# Altium project RF-UNIT.PrjPcb
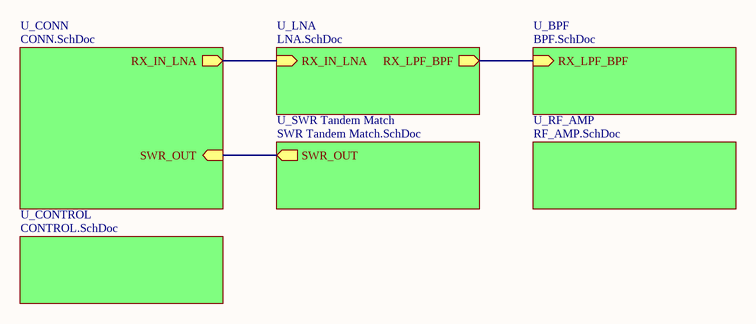
[diagram p0: RF-UNIT.SCHDOC]
7 sheets, 244 parts. Net scope: global (net labels, ports and power ports of the same name join across sheets).
Board file: RF-UNIT.PcbDoc
Sheets:
  RF-UNIT.SCHDOC
    U_BPF = BPF.SchDoc
    U_CONN = CONN.SchDoc
    U_CONTROL = CONTROL.SchDoc
    U_LNA = LNA.SchDoc
    U_RF_AMP = RF_AMP.SchDoc
    U_SWR Tandem Match = SWR Tandem Match.SchDoc

## Sheet RF-UNIT.SCHDOC: RF-UNIT
size A4; DocumentNumber: 12; Revision: 1.9; SheetNumber: 12; SheetTotal: 18

### Sub-sheets
U_BPF = BPF.SchDoc: RX_LPF_BPF (in)
U_CONN = CONN.SchDoc: RX_IN_LNA (out), SWR_OUT (in)
U_CONTROL = CONTROL.SchDoc: no entries
U_LNA = LNA.SchDoc: RX_IN_LNA (in), RX_LPF_BPF (out)
U_RF_AMP = RF_AMP.SchDoc: no entries
U_SWR Tandem Match = SWR Tandem Match.SchDoc: SWR_OUT (out)

### Nets
(unnamed): sheet U_BPF/RX_LPF_BPF, sheet U_LNA/RX_LPF_BPF
(unnamed): sheet U_CONN/RX_IN_LNA, sheet U_LNA/RX_IN_LNA
(unnamed): sheet U_CONN/SWR_OUT, sheet U_SWR Tandem Match/SWR_OUT

### Notes on the sheet
- Title
- Size:
- Date:
- A4
- Number:
- Time:
- Revision:
- Sheet
- of
- File:

## Sheet BPF.SchDoc: BPF
size A2 portrait; DocumentNumber: 13; Revision: 2.0; SheetNumber: 13; SheetTotal: 18; DocumentName: Лист 1.SCHDOC
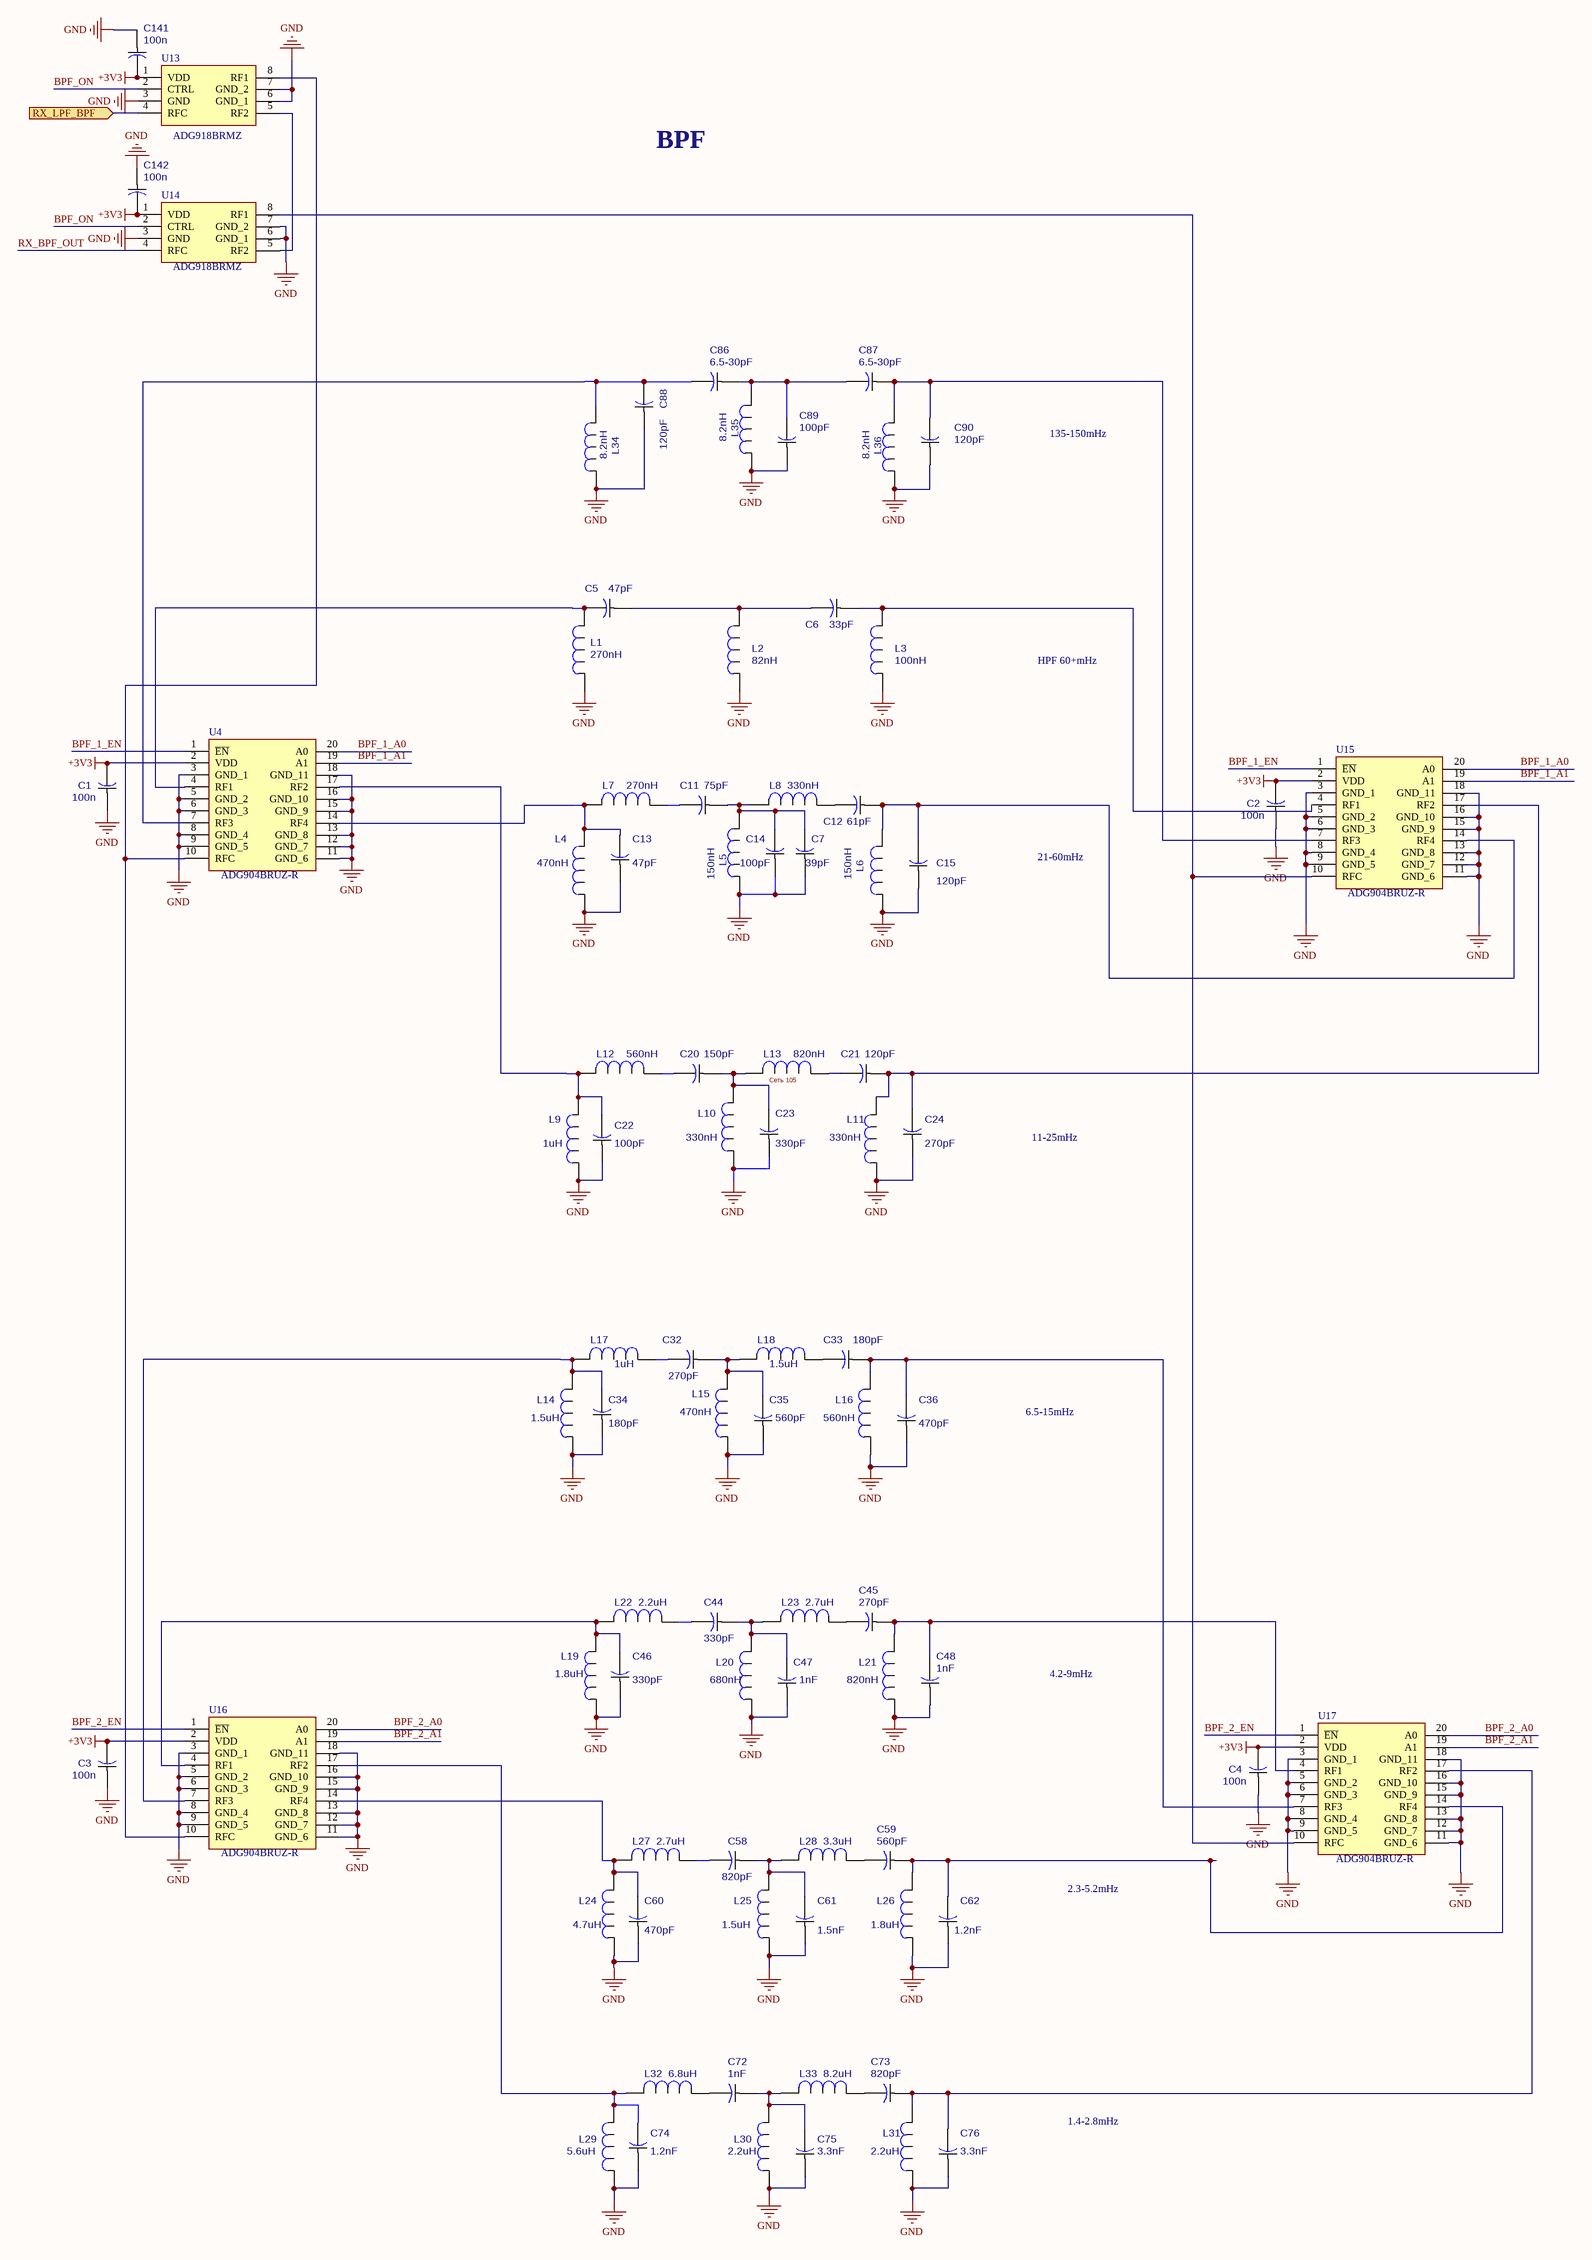
[diagram p1: BPF.SchDoc]

### Parts
C1  100n  [CAP_0805]
C2  100n  [CAP_0805]
C3  100n  [CAP_0805]
C4  100n  [CAP_0805]
C5  47pF  [CAP_0805]
C6  33pF  [CAP_0805]
C7  39pF  [CAP_0805]
C11  75pF  [CAP_0805]
C12  61pF  [CAP_0805]
C13  47pF  [CAP_0805]
C14  100pF  [CAP_0805]
C15  120pF  [CAP_0805]
C20  150pF  [CAP_0805]
C21  120pF  [CAP_0805]
C22  100pF  [CAP_0805]
C23  330pF  [CAP_0805]
C24  270pF  [CAP_0805]
C32  270pF  [CAP_0805]
C33  180pF  [CAP_0805]
C34  180pF  [CAP_0805]
C35  560pF  [CAP_0805]
C36  470pF  [CAP_0805]
C44  330pF  [CAP_0805]
C45  value 270pF  [CAP_0805]  (hidden comment: 51pF)
C46  330pF  [CAP_0805]
C47  1nF  [CAP_0805]
C48  1nF  [CAP_0805]
C58  820pF  [CAP_0805]
C59  value 560pF  [CAP_0805]  (hidden comment: 680pF)
C60  470pF  [CAP_0805]
C61  1.5nF  [CAP_0805]
C62  1.2nF  [CAP_0805]
C72  1nF  [CAP_0805]
C73  820pF  [CAP_0805]
C74  1.2nF  [CAP_0805]
C75  3.3nF  [CAP_0805]
C76  3.3nF  [CAP_0805]
C86  6.5-30pF  [5025[2010]]
C87  6.5-30pF  [5025[2010]]
C88  120pF  [CAP_0805]
C89  100pF  [CAP_0805]
C90  120pF  [CAP_0805]
C141  100n  [CAP_0805]
C142  100n  [CAP_0805]
L1  270nH  [IND_0805]
L2  82nH  [IND_0805]
L3  100nH  [IND_0805]
L4  470nH  [IND_0805]
L5  150nH  [IND_0805]
L6  150nH  [IND_0805]
L7  270nH  [IND_0805]
L8  330nH  [IND_0805]
L9  1uH  [IND_0805]
L10  330nH  [IND_0805]
L11  330nH  [IND_0805]
L12  560nH  [IND_0805]
L13  820nH  [IND_0805]
L14  1.5uH  [IND_0805]
L15  470nH  [IND_0805]
L16  560nH  [IND_0805]
L17  1uH  [IND_0805]
L18  1.5uH  [IND_0805]
L19  1.8uH  [IND_0805]
L20  680nH  [IND_0805]
L21  820nH  [IND_0805]
L22  2.2uH  [IND_0805]
L23  2.7uH  [IND_0805]
L24  4.7uH  [IND_0805]
L25  1.5uH  [IND_0805]
L26  1.8uH  [IND_0805]
L27  2.7uH  [IND_0805]
L28  3.3uH  [IND_0805]
L29  5.6uH  [IND_0805]
L30  2.2uH  [IND_0805]
L31  2.2uH  [IND_0805]
L32  6.8uH  [IND_0805]
L33  8.2uH  [IND_0805]
L34  8.2nH  [IND_0805]
L35  8.2nH  [IND_0805]
L36  8.2nH  [IND_0805]
U4  ADG904BRUZ-R  [SOP65P640X120-20N]
U13  ADG918BRMZ  [SOP65P490X110-8N]
U14  ADG918BRMZ  [SOP65P490X110-8N]
U15  ADG904BRUZ-R  [SOP65P640X120-20N]
U16  ADG904BRUZ-R  [SOP65P640X120-20N]
U17  ADG904BRUZ-R  [SOP65P640X120-20N]

### Ports
RX_LPF_BPF (in)

### Nets
+3V3: C1.2 C2.2 C3.2 C4.2 C141.2 C142.2 U4.2(VDD) U13.1(VDD) U14.1(VDD) U15.2(VDD) U16.2(VDD) U17.2(VDD)
GND: C1.1 C2.1 C3.1 C4.1 C7.1 C13.1 C14.1 C15.1 C22.1 C23.1 C24.1 C34.1 C35.1 C36.1 C46.1 C47.1 C48.1 C60.1 C61.1 C62.1 C74.1 C75.1 C76.1 C88.1 C89.1 C90.1 C141.1 C142.1 L1.1 L2.1 L3.1 L4.1 L5.1 L6.1 L9.1 L10.1 L11.1 L14.1 L15.1 L16.1 L19.1 L20.1 L21.1 L24.1 L25.1 L26.1 L29.1 L30.1 L31.1 L34.1 L35.1 L36.1 U4.3(GND_1) U4.5(GND_2) U4.6(GND_3) U4.8(GND_4) U4.9(GND_5) U4.11(GND_6) U4.12(GND_7) U4.13(GND_8) U4.15(GND_9) U4.16(GND_10) U4.18(GND_11) U13.3(GND) U13.6(GND_1) U13.7(GND_2) U14.3(GND) U14.6(GND_1) U14.7(GND_2) U15.3(GND_1) U15.5(GND_2) U15.6(GND_3) U15.8(GND_4) U15.9(GND_5) U15.11(GND_6) U15.12(GND_7) U15.13(GND_8) U15.15(GND_9) U15.16(GND_10) U15.18(GND_11) U16.3(GND_1) U16.5(GND_2) U16.6(GND_3) U16.8(GND_4) U16.9(GND_5) U16.11(GND_6) U16.12(GND_7) U16.13(GND_8) U16.15(GND_9) U16.16(GND_10) U16.18(GND_11) U17.3(GND_1) U17.5(GND_2) U17.6(GND_3) U17.8(GND_4) U17.9(GND_5) U17.11(GND_6) U17.12(GND_7) U17.13(GND_8) U17.15(GND_9) U17.16(GND_10) U17.18(GND_11)
BPF_1_A0: U4.20(A0) U15.20(A0)
BPF_1_A1: U4.19(A1) U15.19(A1)
BPF_1_EN: U4.1(~{EN}) U15.1(~{EN})
BPF_2_A0: U16.20(A0) U17.20(A0)
BPF_2_A1: U16.19(A1) U17.19(A1)
BPF_2_EN: U16.1(~{EN}) U17.1(~{EN})
BPF_ON: U13.2(CTRL) U14.2(CTRL)
RX_BPF_OUT: U14.4(RFC)
RX_LPF_BPF: U13.4(RFC) ; port RX_LPF_BPF
Сеть 105: C20.1 C23.2 L10.2 L13.1
NetC5_1: C5.1 C6.2 L2.2
NetC5_2: C5.2 L1.2 U4.4(RF1)
NetC6_1: C6.1 L3.2 U15.4(RF1)
NetC7_2: C7.2 C11.1 C14.2 L5.2 L8.1
NetC11_2: C11.2 L7.2
NetC12_1: C12.1 C15.2 L6.2 U15.14(RF4)
NetC12_2: C12.2 L8.2
NetC13_2: C13.2 L4.2 L7.1 U4.14(RF4)
NetC20_2: C20.2 L12.2
NetC21_1: C21.1 C24.2 L11.2 U15.17(RF2)
NetC21_2: C21.2 L13.2
NetC22_2: C22.2 L9.2 L12.1 U4.17(RF2)
NetC32_1: C32.1 C35.2 L15.2 L18.1
NetC32_2: C32.2 L17.2
NetC33_1: C33.1 C36.2 L16.2 U17.7(RF3)
NetC33_2: C33.2 L18.2
NetC34_2: C34.2 L14.2 L17.1 U16.7(RF3)
NetC44_1: C44.1 C47.2 L20.2 L23.1
NetC44_2: C44.2 L22.2
NetC45_1: C45.1 C48.2 L21.2 U17.4(RF1)
NetC45_2: C45.2 L23.2
NetC46_2: C46.2 L19.2 L22.1 U16.4(RF1)
NetC58_1: C58.1 C61.2 L25.2 L28.1
NetC58_2: C58.2 L27.2
NetC59_1: C59.1 C62.2 L26.2 U17.14(RF4)
NetC59_2: C59.2 L28.2
NetC60_2: C60.2 L24.2 L27.1 U16.14(RF4)
NetC72_1: C72.1 C75.2 L30.2 L33.1
NetC72_2: C72.2 L32.2
NetC73_1: C73.1 C76.2 L31.2 U17.17(RF2)
NetC73_2: C73.2 L33.2
NetC74_2: C74.2 L29.2 L32.1 U16.17(RF2)
NetC86_1: C86.1 C87.2 C89.2 L35.2
NetC86_2: C86.2 C88.2 L34.2 U4.7(RF3)
NetC87_1: C87.1 C90.2 L36.2 U15.7(RF3)
NetU4_10: U4.10(RFC) U13.8(RF1) U16.10(RFC)
NetU13_5: U13.5(RF2) U14.5(RF2)
NetU14_8: U14.8(RF1) U15.10(RFC) U17.10(RFC)

### Notes on the sheet
- BPF
- 135-150mHz
- HPF 60+mHz
- 21-60mHz
- 11-25mHz
- 6.5-15mHz
- 4.2-9mHz
- 2.3-5.2mHz
- 1.4-2.8mHz
- Title
- Size:
- Date:
- File:
- A2
- Number:
- Time:
- Revision:
- Sheet
- of

### Library data of the parts
C1-C7 C11-C15 C20-C24 C32-C36 C44-C48 C58-C62 C72-C76 C88-C90 C141 C142 = CAP_0805
  C1-C4 C141 C142: Value: 100n
  C5 C13: Value: 47pF
  C6: Value: 33pF
  C7: Value: 39pF
  C11: Value: 75pF
  C12: Value: 61pF
  C14 C89: Value: 100pF
  C15 C88 C90: Value: 120pF
  C44 C46: Value: 330pF
  C47 C48 C72: Value: 1nF
  C58 C73: Value: 820pF
  C60: Value: 470pF
  C61: Value: 1.5nF
  C62 C74: Value: 1.2nF
  C75 C76: Value: 3.3nF
C86 C87 = CAP_0805: TZC3P300A110; Value: 6.5-30pF
L1-L36 = IND_0805
  L1 L7: Value: 270nH
  L2: Value: 82nH
  L3: Value: 100nH
  L4: Value: 470nH
  L5 L6: Value: 150nH
  L8: Value: 330nH
  L19 L26: Value: 1.8uH
  L20: Value: 680nH
  L21: Value: 820nH
  L22 L30 L31: Value: 2.2uH
  L23 L27: Value: 2.7uH
  L24: Value: 4.7uH
  L25: Value: 1.5uH
  L28: Value: 3.3uH
  L29: Value: 5.6uH
  L32: Value: 6.8uH
  L33: Value: 8.2uH
  L34-L36: Value: 8.2nH
U4 U15-U17 = ADG904BRUZ-R: Integrated Circuit; Manufacturer_Name: Analog Devices; Datasheet Link: http://www.analog.com/static/imported-files/data_sheets/ADG904_904R.pdf; Height: 1.2mm; Manufacturer_Part_Number: ADG904BRUZ-R; Mouser Part Number: 584-ADG904BRUZ-R; Mouser Price/Stock: https://www.mouser.com/Search/Refine.aspx?Keyword=584-ADG904BRUZ-R; RS Part Number: 5385019P; RS Price/Stock: http://uk.rs-online.com/web/p/products/5385019P
U13 U14 = ADG918BRMZ: Integrated Circuit; Manufacturer_Name: Analog Devices; Datasheet Link: http://www.analog.com/static/imported-files/data_sheets/ADG918_919.pdf; Height: 1.1mm; Manufacturer_Part_Number: ADG918BRMZ; Mouser Part Number: 584-ADG918BRMZ; Mouser Price/Stock: https://www.mouser.co.uk/ProductDetail/Analog-Devices/ADG918BRMZ?qs=BpaRKvA4VqHrp1TCwMhfnw%3D%3D; RS Part Number: 4969212P; RS Price/Stock: http://uk.rs-online.com/web/p/products/4969212P
  U14: LCSC Part #: test

## Sheet CONN.SchDoc: CONN
size A4; DocumentNumber: 14; Revision: 2.0; SheetNumber: 14; SheetTotal: 18
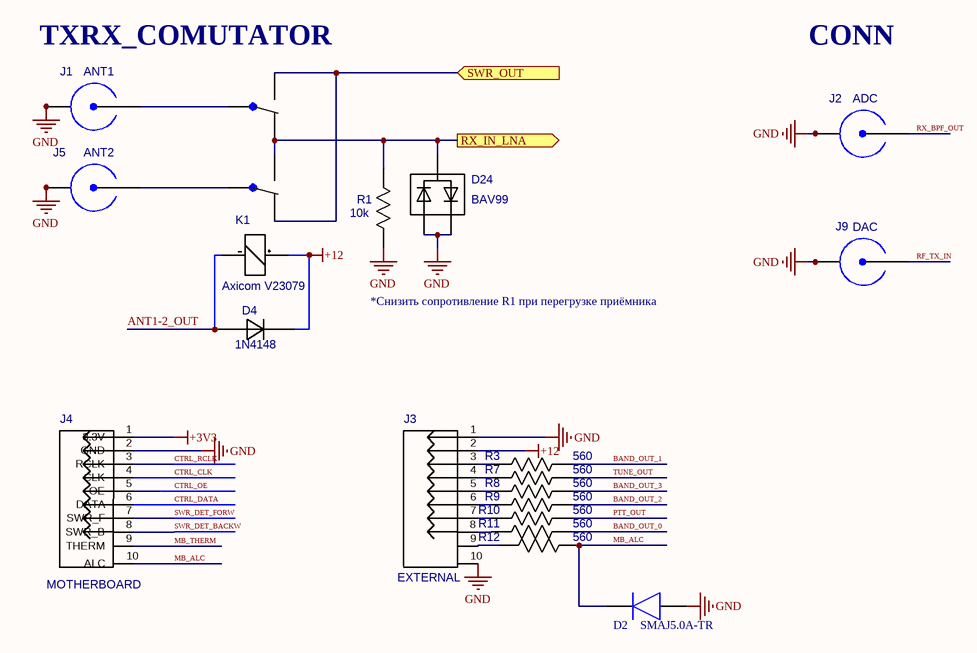
[diagram p2: CONN.SchDoc]

### Parts
D2  SMAJ5.0A-TR  [SMBJ36CATR]
D4  1N4148  [1N4148]
D24  BAV99  [SOT23]
J1  ANT1  [31-5431]
J2  ADC  [31-5431]
J3  EXTERNAL  [90131-0126]
J4  MOTHERBOARD  [90131-0126]
J5  ANT2  [31-5431]
J9  DAC  [31-5431]
K1  Axicom V23079  [V23079]
R1  10k  [RES_1206]
R3  560  [RES_0805]
R7  560  [RES_0805]
R8  560  [RES_0805]
R9  560  [RES_0805]
R10  560  [RES_0805]
R11  560  [RES_0805]
R12  560  [RES_0805]

### Ports
RX_IN_LNA (out), SWR_OUT (in)

### Nets
+3V3: J4.1(3.3V)
+12: D4.1(K) J3.2(12V) K1.1(+)
GND: D2.2(A) D24.1(A(D1)) D24.2(C(D2)) J1.1(GND) J1.2(GND) J1.3(GND) J1.4(GND) J2.1(GND) J2.2(GND) J2.3(GND) J2.4(GND) J3.1(GND) J3.10(GND) J4.2(GND) J5.1(GND) J5.2(GND) J5.3(GND) J5.4(GND) J9.1(GND) J9.2(GND) J9.3(GND) J9.4(GND) R1.1
ANT1-2_OUT: D4.2(A) K1.8(-)
BAND_OUT_0: R11.2
BAND_OUT_1: R3.2
BAND_OUT_2: R9.2
BAND_OUT_3: R8.2
CTRL_CLK: J4.4(CLK)
CTRL_DATA: J4.6(DATA)
CTRL_OE: J4.5(OE)
CTRL_RCLK: J4.3(RCLK)
MB_ALC: D2.1(K) J4.10(ALC) R12.2
MB_THERM: J4.9(THERM)
PTT_OUT: R10.2
RF_TX_IN: J9.5(CON)
RX_BPF_OUT: J2.5(CON)
RX_IN_LNA: D24.3(C(D1),A(D2)) K1.4(S) K1.7(O) R1.2 ; port RX_IN_LNA
SWR_DET_BACKW: J4.8(SWR_B)
SWR_DET_FORW: J4.7(SWR_F)
SWR_OUT: K1.2(O) K1.5(S) ; port SWR_OUT
TUNE_OUT: R7.2
NetJ1_5: J1.5(CON) K1.6(P)
NetJ3_3: J3.3(BAND1) R3.1
NetJ3_4: J3.4(TUNE_OUT) R7.1
NetJ3_5: J3.5(BAND3) R8.1
NetJ3_6: J3.6(BAND2) R9.1
NetJ3_7: J3.7(PTT_OUT) R10.1
NetJ3_8: J3.8(BAND0) R11.1
NetJ3_9: J3.9(ALC_IN) R12.1
NetJ5_5: J5.5(CON) K1.3(P)

### Notes on the sheet
- TXRX_COMUTATOR
- CONN
- *Снизить сопротивление R1 при перегрузке приёмника
- Title
- Size:
- Date:
- A4
- Number:
- Time:
- Revision:
- Sheet
- of
- File:

### Library data of the parts
D2 = SMLVT3V3: Diode; Manufacturer_Name: STMicroelectronics; Allied_Number: 70013736; Datasheet Link: http://www.st.com/web/en/resource/technical/document/datasheet/CD00000923.pdf; Height: 2.65mm; Manufacturer_Part_Number: SMLVT3V3; Mouser Part Number: 511-SMLVT3V3; Mouser Price/Stock: https://www.mouser.com/Search/Refine.aspx?Keyword=511-SMLVT3V3; RS Part Number: 5444821P; RS Price/Stock: http://uk.rs-online.com/web/p/products/5444821P; Allied Price/Stock: http://www.alliedelec.com/stmicroelectronics-smlvt3v3/70013736/
J1 J2 J5 J9 = 31-5431: SMA
  J1: Value: ANT1
  J2: Value: ADC
  J5: Value: ANT2
  J9: Value: DAC
J3 J4 = 90131-0126: 2*5 PIN; Value: *
R1 = RES_1206
R3 R7-R12 = RES_0805: Value: 560
D4 = 1N4148: Value: 1N4148
D24 = BAV99: Value: BAV99
K1 = Axicom V23079: Value: *

## Sheet CONTROL.SchDoc: CONTROL
size A4; DocumentNumber: 15; Revision: 2.0; SheetNumber: 15; SheetTotal: 18
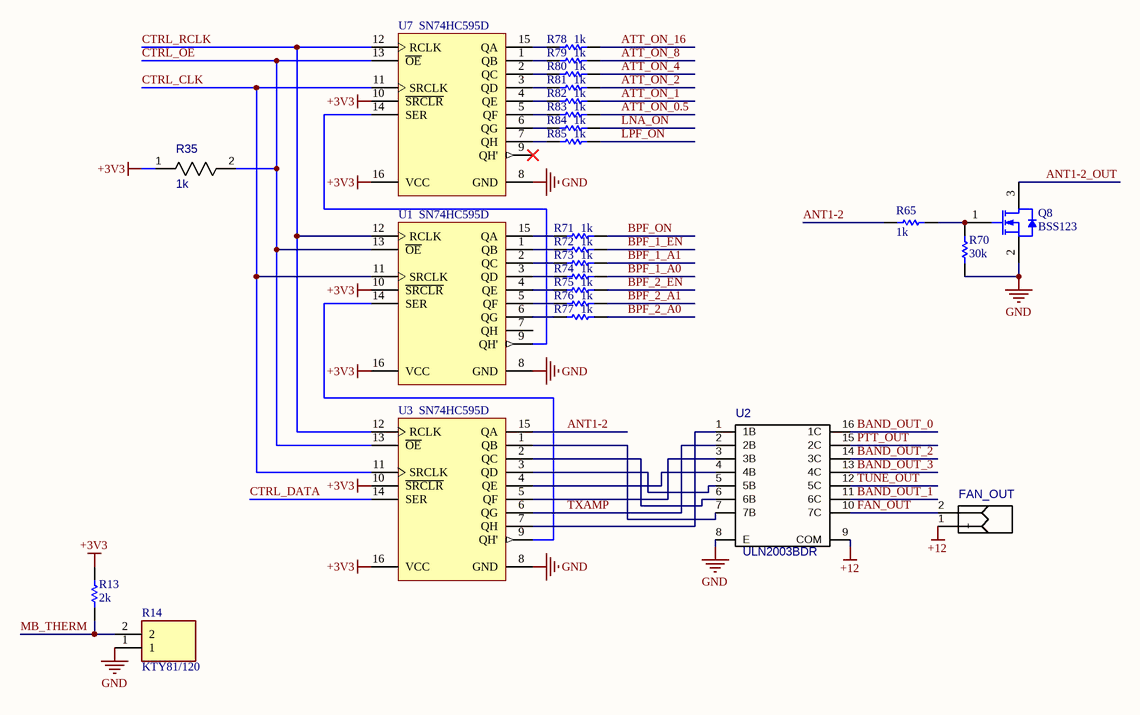
[diagram p3: CONTROL.SchDoc]

### Parts
FAN_OUT  51022-0200  [51022-0200]  (value not drawn)
Q8  BSS123  [FAIR-SOT23-3_V]
R13  2k  [RESC2013X60X40NL20T25]
R14  KTY81/120  [TO254P420X460X770-2P]
R35  1k  [RES_0805]
R65  1k  [RESC2013X60X40NL20T25]
R70  30k  [RESC2013X60X40NL20T25]
R71  1k  [RESC2013X60X40NL20T25]
R72  1k  [RESC2013X60X40NL20T25]
R73  1k  [RESC2013X60X40NL20T25]
R74  1k  [RESC2013X60X40NL20T25]
R75  1k  [RESC2013X60X40NL20T25]
R76  1k  [RESC2013X60X40NL20T25]
R77  1k  [RESC2013X60X40NL20T25]
R78  1k  [RESC2013X60X40NL20T25]
R79  1k  [RESC2013X60X40NL20T25]
R80  1k  [RESC2013X60X40NL20T25]
R81  1k  [RESC2013X60X40NL20T25]
R82  1k  [RESC2013X60X40NL20T25]
R83  1k  [RESC2013X60X40NL20T25]
R84  1k  [RESC2013X60X40NL20T25]
R85  1k  [RESC2013X60X40NL20T25]
U1  SN74HC595D  [D0016A_L]
U2  ULN2003BDR  [ULN2003BDR]
U3  SN74HC595D  [D0016A_L]
U7  SN74HC595D  [D0016A_L]

### Nets
+3V3: R13.1 R35.1 U1.10(~{SRCLR}) U1.16(VCC) U3.10(~{SRCLR}) U3.16(VCC) U7.10(~{SRCLR}) U7.16(VCC)
+12: FAN_OUT.1(+) U2.9(COM)
GND: Q8.2(S) R14.1 R70.1 U1.8(GND) U2.8(E) U3.8(GND) U7.8(GND)
ANT1-2: R65.2 U3.15(QA)
ANT1-2_OUT: Q8.3(D)
ATT_ON_0.5: R83.1
ATT_ON_1: R82.1
ATT_ON_2: R81.1
ATT_ON_4: R80.1
ATT_ON_8: R79.1
ATT_ON_16: R78.1
BAND_OUT_0: U2.16(1C)
BAND_OUT_1: U2.11(6C)
BAND_OUT_2: U2.14(3C)
BAND_OUT_3: U2.13(4C)
BPF_1_A0: R74.1
BPF_1_A1: R73.1
BPF_1_EN: R72.1
BPF_2_A0: R77.1
BPF_2_A1: R76.1
BPF_2_EN: R75.1
BPF_ON: R71.1
CTRL_CLK: U1.11(SRCLK) U3.11(SRCLK) U7.11(SRCLK)
CTRL_DATA: U3.14(SER)
CTRL_OE: R35.2 U1.13(~{OE}) U3.13(~{OE}) U7.13(~{OE})
CTRL_RCLK: U1.12(RCLK) U3.12(RCLK) U7.12(RCLK)
FAN_OUT: FAN_OUT.2(-) U2.10(7C)
LNA_ON: R84.1
LPF_ON: R85.1
MB_THERM: R13.2 R14.2
PTT_OUT: U2.15(2C)
TUNE_OUT: U2.12(5C)
TXAMP: U2.2(2B) U3.6(QG)
NetQ8_1: Q8.1(G) R65.1 R70.2
NetR71_2: R71.2 U1.15(QA)
NetR72_2: R72.2 U1.1(QB)
NetR73_2: R73.2 U1.2(QC)
NetR74_2: R74.2 U1.3(QD)
NetR75_2: R75.2 U1.4(QE)
NetR76_2: R76.2 U1.5(QF)
NetR77_2: R77.2 U1.6(QG)
NetR78_2: R78.2 U7.15(QA)
NetR79_2: R79.2 U7.1(QB)
NetR80_2: R80.2 U7.2(QC)
NetR81_2: R81.2 U7.3(QD)
NetR82_2: R82.2 U7.4(QE)
NetR83_2: R83.2 U7.5(QF)
NetR84_2: R84.2 U7.6(QG)
NetR85_2: R85.2 U7.7(QH)
NetU1_9: U1.9(QH') U7.14(SER)
NetU1_14: U1.14(SER) U3.9(QH')
NetU2_1: U2.1(1B) U3.7(QH)
NetU2_3: U2.3(3B) U3.5(QF)
NetU2_4: U2.4(4B) U3.4(QE)
NetU2_5: U2.5(5B) U3.3(QD)
NetU2_6: U2.6(6B) U3.2(QC)
NetU2_7: U2.7(7B) U3.1(QB)

Not connected (* = marked no-connect by the designer): U1 7(QH); U7 9(QH')*

### Notes on the sheet
- Title
- Size:
- Date:
- A4
- Number:
- Time:
- Revision:
- Sheet
- of
- File:

### Library data of the parts
Q8 = CMP-2000-04934-1: N-Channel Logic Level Enhancement Mode Field Effect Transistor, 1.7 V, -55 to 150 degC, 3-Pin SOT-23, RoHS, Tape and Reel; Manufacturer: Fairchild; Channel Type: N; Typical Turn-Off Delay Time: 17ns; Maximum Continuous Drain Current: 0.17A; Rad Hard: No; Typical Rise Time: 9ns; Typical Fall Time: 2.4ns; Maximum Gate Source Voltage: ±20V; Maximum Drain Source Voltage: 100V; Typical Turn-On Delay Time: 1.7ns; RDS-on: 6000@10VmOhm; Package Version: Rev. 12, 03/2016; Packaging: Tape&Reel; Package Reference: SOT23-3; Channel Mode: Enhancement; Operating Temperature: -55to150degC; Package Description: 3-Pin Small Outline Transistor, Body 2.92 x 1.325 mm, Pitch 0.95 mm; Category: MOSFET; Datasheet Version: Jun-03; Datasheet URL: https://www.fairchildsemi.com/datasheets/BS/BSS123.pdf; Manufacturer URL: https://www.fairchildsemi.com/; Mounting: SurfaceMount; Package: 3SOT-23; Package URL: http://www.fairchildsemi.com/dwg/MA/MA03D.pdf
R13 R65 R70-R85 = CMP-2001-00626-1: RES_0805; Manufacturer: Panasonic; Part Number: ERA-6AEB303V
R14 = KTY81_110: Integrated Circuit; Manufacturer_Name: Nexperia; Manufacturer_Part_Number: KTY81/110; Datasheet Link: https://www.nxp.com/docs/en/data-sheet/KTY81_SER.pdf; Height: 4.2mm
R35 = RES_0805: Value: 1k
U1 U3 U7 = CMP-0780-00038-3: 8-Bit Shift Registers With 3-State Output Registers, D0016A, TUBE; Manufacturer: Texas Instruments; Bits: 8; F @ Nom Voltage(Max)(Mhz): 28; Voltage(Nom)(V): 6; ICC @ Nom Voltage(Max)(mA): 0.08; Output Drive (IOL/IOH)(Max)(mA): 7.8/-7.8; tpd @ Nom Voltage(Max)(ns): 34; 3-State Output: Yes; VCC(Min)(V): 2; Output Type: CMOS; Technology Family: HC; Rating: Military; Generic Part Number: SN74HC595; PackageReference: D0016A; Code_JEDEC: MS-012 variation AC; Operating Temperature Range(C): -40 to 85; VCC(Max)(V): 6; DatasheetVersion: SCLS041H; Input Type: CMOS; PackageVersion: http://www.ti.com/lit/ml/mpds178g/mpds178g.pdf
U2 = ULN2003BDR: Value: *

## Sheet LNA.SchDoc: LNA
size A4; DocumentNumber: 16; Revision: 2.0; SheetNumber: 16; SheetTotal: 18
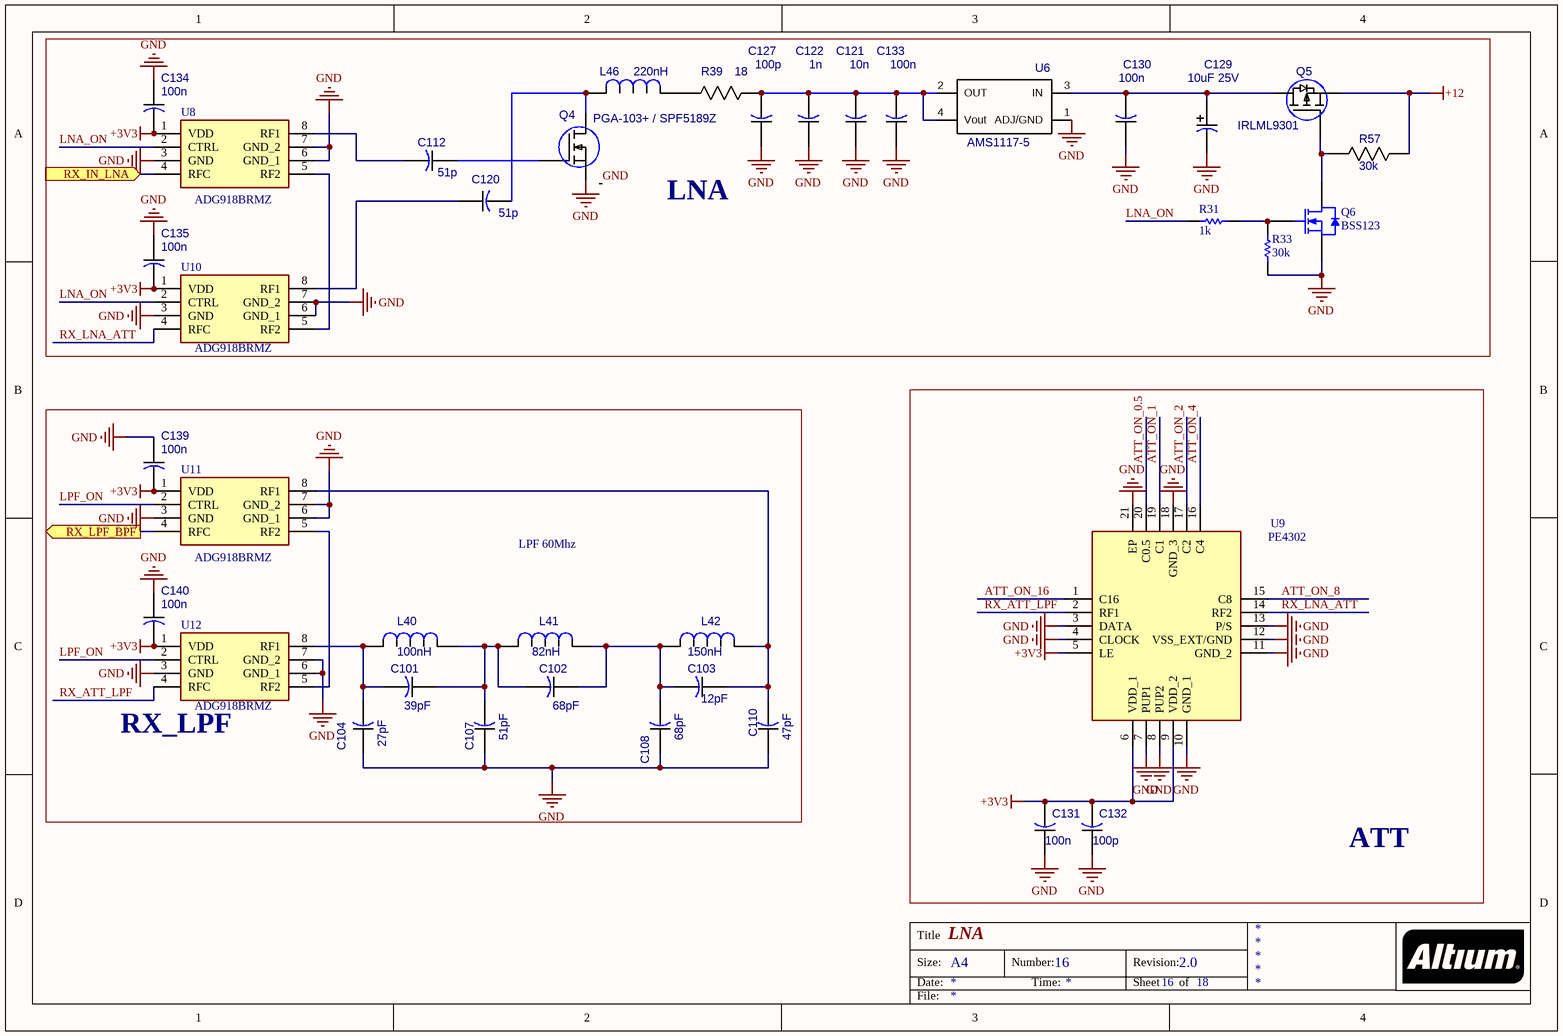
[diagram p4: LNA.SchDoc]

### Parts
C101  39pF  [CAP_0805]
C102  68pF  [CAP_0805]
C103  12pF  [CAP_0805]
C104  27pF  [CAP_0805]
C107  51pF  [CAP_0805]
C108  68pF  [CAP_0805]
C110  47pF  [CAP_0805]
C112  51p  [CAP_0805]
C120  51p  [CAP_0805]
C121  10n  [6-0805_M]
C122  1n  [6-0805_M]
C127  100p  [6-0805_M]
C129  10uF 25V  [CAPAE_5.3x5.3h6.1]
C130  100n  [CAP_0805]
C131  100n  [6-0805_M]
C132  100p  [6-0805_M]
C133  100n  [CAP_0805]
C134  100n  [CAP_0805]
C135  100n  [CAP_0805]
C139  100n  [CAP_0805]
C140  100n  [CAP_0805]
L40  100nH  [IND_0805]
L41  82nH  [IND_0805]
L42  150nH  [IND_0805]
L46  220nH  [IND_1206]
Q4  PGA-103+ / SPF5189Z  [SOT89]
Q5  IRLML9301  [SOT23]
Q6  BSS123  [FAIR-SOT23-3_V]
R31  1k  [RESC2013X60X40NL20T25]
R33  30k  [RESC2013X60X40NL20T25]
R39  18  [RES_1206]
R57  30k  [RES_0805]
U6  AMS1117-5  [AMS1117-5]
U8  ADG918BRMZ  [SOP65P490X110-8N]
U9  PE4302  [QFN50P400X400X90-21N]
U10  ADG918BRMZ  [SOP65P490X110-8N]
U11  ADG918BRMZ  [SOP65P490X110-8N]
U12  ADG918BRMZ  [SOP65P490X110-8N]

### Blocks framed on the sheet
LNA: C112 C120-C122 C127 C129 C130 C133-C135 L46 Q4-Q6 R31 R33 R39 R57 U6 U8 U10
RX_LPF: C101-C104 C107 C108 C110 C139 C140 L40-L42 U11 U12
ATT: C131 C132 U9

### Ports
RX_IN_LNA (in), RX_LPF_BPF (out)

### Nets
+3V3: C131.2 C132.2 C134.2 C135.2 C139.2 C140.2 U8.1(VDD) U9.5(LE) U9.6(VDD_1) U9.9(VDD_2) U10.1(VDD) U11.1(VDD) U12.1(VDD)
+12: Q5.2(S) R57.2
GND: C104.1 C107.1 C108.1 C110.1 C121.1 C122.1 C127.1 C129.2(MINUS) C130.1 C131.1 C132.1 C133.1 C134.1 C135.1 C139.1 C140.1 Q4.0 Q4.2(S) Q6.2(S) R33.1 U6.1(ADJ/GND) U8.3(GND) U8.6(GND_1) U8.7(GND_2) U9.3(DATA) U9.4(CLOCK) U9.7(PUP1) U9.8(PUP2) U9.10(GND_1) U9.11(GND_2) U9.12(VSS_EXT/GND) U9.13(P/S) U9.18(GND_3) U9.21(EP) U10.3(GND) U10.6(GND_1) U10.7(GND_2) U11.3(GND) U11.6(GND_1) U11.7(GND_2) U12.3(GND) U12.6(GND_1) U12.7(GND_2)
ATT_ON_0.5: U9.20(C0.5)
ATT_ON_1: U9.19(C1)
ATT_ON_2: U9.17(C2)
ATT_ON_4: U9.16(C4)
ATT_ON_8: U9.15(C8)
ATT_ON_16: U9.1(C16)
LNA_ON: R31.2 U8.2(CTRL) U10.2(CTRL)
LPF_ON: U11.2(CTRL) U12.2(CTRL)
RX_ATT_LPF: U9.2(RF1) U12.4(RFC)
RX_IN_LNA: U8.4(RFC) ; port RX_IN_LNA
RX_LNA_ATT: U9.14(RF2) U10.4(RFC)
RX_LPF_BPF: U11.4(RFC) ; port RX_LPF_BPF
NetC101_1: C101.1 C102.2 C107.2 L40.2 L41.1
NetC101_2: C101.2 C104.2 L40.1 U12.8(RF1)
NetC102_1: C102.1 C103.2 C108.2 L41.2 L42.1
NetC103_1: C103.1 C110.2 L42.2 U11.8(RF1)
NetC112_1: C112.1 Q4.1(G)
NetC112_2: C112.2 U8.8(RF1)
NetC120_1: C120.1 U10.8(RF1)
NetC120_2: C120.2 L46.2 Q4.3(D)
NetC121_2: C121.2 C122.2 C127.2 C133.2 R39.1 U6.2(OUT) U6.4(Vout)
NetC129_1: C129.1(PLUS) C130.2 Q5.3(D) U6.3(IN)
NetL46_1: L46.1 R39.2
NetQ5_1: Q5.1(G) Q6.3(D) R57.1
NetQ6_1: Q6.1(G) R31.1 R33.2
NetU8_5: U8.5(RF2) U10.5(RF2)
NetU11_5: U11.5(RF2) U12.5(RF2)

### Notes on the sheet
- LPF 60Mhz
- Title
- Size:
- Date:
- A4
- Number:
- Time:
- Revision:
- Sheet
- of
- File:

### Library data of the parts
C101-C104 C107 C108 C110 C112 C120-C122 C127 C130-C135 C139 C140 = CAP_0805
  C121: Value: 10n
  C122: Value: 1n
  C127 C132: Value: 100p
  C130 C131 C133-C135 C139 C140: Value: 100n
C129 = CAPAE_5.3x5.3h6.1: Value: 10uF 25V
L40-L42 = IND_0805
L46 = IND_1206: Value: 220nH
Q4 = PGA-103+
Q5 = MOSFET_ENH_PD: MOSFET; Value: IRLML9301
Q6 = CMP-2000-04934-1: as Q8 on sheet CONTROL; Packaging: Tape&Reel; Package Reference: SOT23-3; Channel Mode: Enhancement; Operating Temperature: -55to150degC; Package Description: 3-Pin Small Outline Transistor, Body 2.92 x 1.325 mm, Pitch 0.95 mm; Category: MOSFET; Datasheet Version: Jun-03; Datasheet URL: https://www.fairchildsemi.com/datasheets/BS/BSS123.pdf; Manufacturer URL: https://www.fairchildsemi.com/; Mounting: SurfaceMount; Package: 3SOT-23; Package URL: http://www.fairchildsemi.com/dwg/MA/MA03D.pdf
R31 R33 = CMP-2001-00626-1: as R13 on sheet CONTROL
R39 = RES_1206: Value: 18
R57 = RES_0805: Value: 30k
U8 U10-U12 = ADG918BRMZ: as U13 on sheet BPF; Datasheet Link: http://www.analog.com/static/imported-files/data_sheets/ADG918_919.pdf; Height: 1.1mm; Manufacturer_Part_Number: ADG918BRMZ; Mouser Part Number: 584-ADG918BRMZ; Mouser Price/Stock: https://www.mouser.co.uk/ProductDetail/Analog-Devices/ADG918BRMZ?qs=BpaRKvA4VqHrp1TCwMhfnw%3D%3D; RS Part Number: 4969212P; RS Price/Stock: http://uk.rs-online.com/web/p/products/4969212P
U9 = PE4312C-Z: Integrated Circuit; Manufacturer_Name: pSemi; Datasheet Link: https://www.psemi.com/pdf/datasheets/pe4312ds.pdf; Height: 0.9mm; Manufacturer_Part_Number: PE4312C-Z; Mouser Part Number: N/A; Mouser Price/Stock: https://www.mouser.com/Search/Refine.aspx?Keyword=N%2FA
U6 = AMS1117-5: Value: AMS1117-5

## Sheet RF_AMP.SchDoc: RF_AMP
size A4; DocumentNumber: 17; Revision: 2.0; SheetNumber: 17; SheetTotal: 18
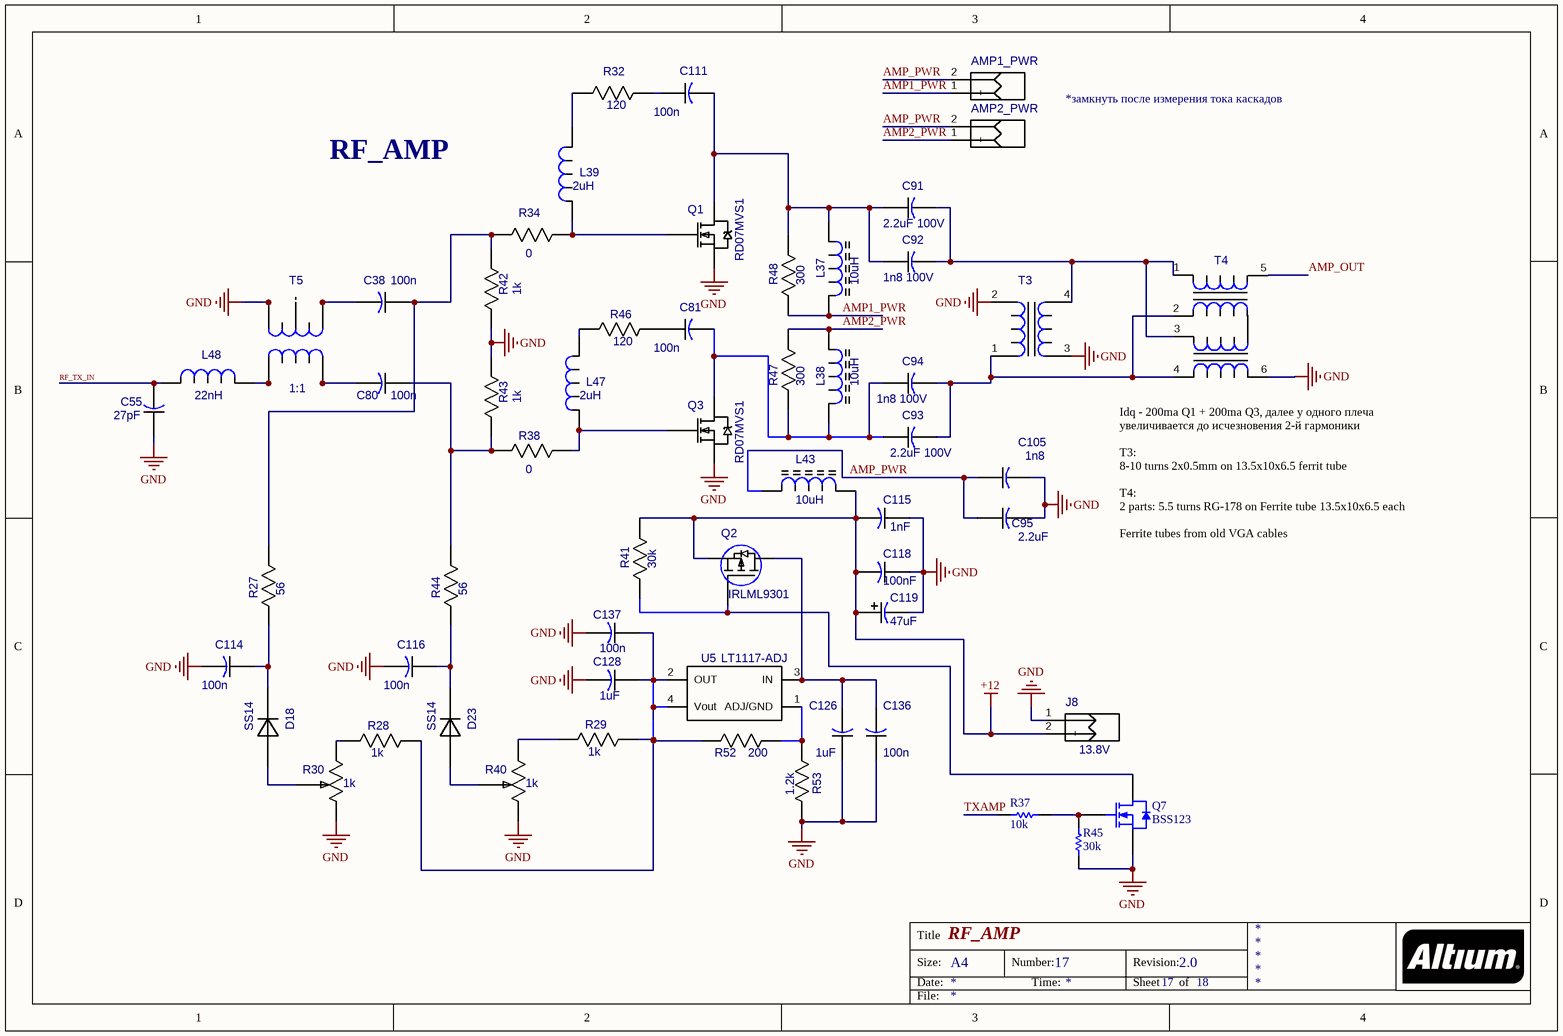
[diagram p5: RF_AMP.SchDoc]

### Parts
AMP1_PWR  51022-0200  [51022-0200]  (value not drawn)
AMP2_PWR  51022-0200  [51022-0200]  (value not drawn)
C38  100n  [CAP_0805]
C55  27pF  [CAP_0805]
C80  100n  [CAP_0805]
C81  100n  [CAP_1206]
C91  2.2uF 100V  [CAP_1206]
C92  1n8 100V  [CAP_1206]
C93  2.2uF 100V  [CAP_1206]
C94  1n8 100V  [CAP_1206]
C95  2.2uF  [CAP_1206]
C105  1n8  [CAP_1206]
C111  100n  [CAP_1206]
C114  100n  [CAP_0805]
C115  1nF  [CAP_0805]
C116  100n  [CAP_0805]
C118  100nF  [CAP_0805]
C119  47uF  [CAPAE_6.6x6.6h5.4]
C126  1uF  [CAP_0805]
C128  1uF  [CAP_0805]
C136  100n  [CAP_0805]
C137  100n  [CAP_0805]
D18  SS14  [SS14]
D23  SS14  [SS14]
J8  value 13.8V  [1986717-2]  (hidden comment: JX2)
L37  10uH  [IND_FERRITE_CORE]
L38  10uH  [IND_FERRITE_CORE]
L39  2uH  [IND_0805]
L43  10uH  [IND_FERRITE_CORE]
L47  2uH  [IND_0805]
L48  22nH  [IND_0805]
Q1  RD07MVS1  [RD07MVS1]
Q2  IRLML9301  [SOT23]
Q3  RD07MVS1  [RD07MVS1]
Q7  BSS123  [FAIR-SOT23-3_V]
R27  56  [RES_0805]
R28  1k  [RES_0805]
R29  1k  [RES_0805]
R30  value 1k  [306J]  (hidden comment: ADJ-1k)
R32  120  [RES_0805]
R34  0  [RES_1206]
R37  10k  [RESC2013X60X40NL20T25]
R38  0  [RES_1206]
R40  value 1k  [306J]  (hidden comment: ADJ-1k)
R41  30k  [RES_0805]
R42  1k  [RES_0805]
R43  1k  [RES_0805]
R44  56  [RES_0805]
R45  30k  [RESC2013X60X40NL20T25]
R46  120  [RES_0805]
R47  300  [RES_1206]
R48  300  [RES_1206]
R52  200  [RES_0805]
R53  1.2k  [RES_0805]
T3  8T M2000HM 10*6*5  [Rutrof]  (value not drawn)
T4  TRANSF_OUT  [TRANSF_OUT]  (value not drawn)
T5  1:1  [TRANSF_ACORE2]
U5  value LT1117-ADJ  [LT1117IST-ADJ]  (hidden comment: LT1117IST-ADJ)

### Nets
+12: C115.2 C118.2 C119.1(PLUS) J8.2(+) L43.2(B) Q2.2(S) R41.2
GND: C55.1 C95.2 C105.2 C114.2 C115.1 C116.2 C118.1 C119.2(MINUS) C126.1 C128.2 C136.1 C137.2 J8.1(-) Q1.2(S) Q3.2(S) Q7.2(S) R30.1(CCW) R40.1(CCW) R42.1 R43.2 R45.1 R53.2 T3.2(P2) T3.3(S1) T4.6(OUT2) T5.3(S3) T5.9
AMP1_PWR: AMP1_PWR.1(+) L37.2(B) R48.1
AMP2_PWR: AMP2_PWR.1(+) L38.1(A) R47.2
AMP_OUT: T4.5(OUT1)
AMP_PWR: AMP1_PWR.2(-) AMP2_PWR.2(-) C95.1 C105.1 L43.1(A)
RF_TX_IN: C55.2 L48.1
TXAMP: R37.2
NetC38_1: C38.1 R27.2 R34.1 R42.2
NetC38_2: C38.2 T5.1(S1) T5.7
NetC80_1: C80.1 R38.1 R43.1 R44.2
NetC80_2: C80.2 T5.6(P1) T5.10
NetC81_1: C81.1 R46.2
NetC81_2: C81.2 C93.1 C94.1 L38.2(B) Q3.1(D) R47.1
NetC91_1: C91.1 C92.1 C111.2 L37.1(A) Q1.1(D) R48.2
NetC91_2: C91.2 C92.2 T3.4(S2) T4.1(T1P) T4.3(T2N)
NetC93_2: C93.2 C94.2 T3.1(P1) T4.2(T1N) T4.4(T2P)
NetC111_1: C111.1 R32.2
NetC114_1: C114.1 D18.1(K) R27.1
NetC116_1: C116.1 D23.1(K) R44.1
NetC126_2: C126.2 C136.2 Q2.3(D) U5.3(IN)
NetC128_1: C128.1 C137.1 R28.2 R29.2 R52.1 U5.2(OUT) U5.4(Vout)
NetD18_2: D18.2(A) R30.2(W)
NetD23_2: D23.2(A) R40.2(W)
NetL39_1: L39.1 Q1.3(G) R34.2
NetL39_2: L39.2 R32.1
NetL47_1: L47.1 Q3.3(G) R38.2
NetL47_2: L47.2 R46.1
NetL48_2: L48.2 T5.4(P2) T5.11
NetQ2_1: Q2.1(G) Q7.3(D) R41.1
NetQ7_1: Q7.1(G) R37.1 R45.2
NetR28_1: R28.1 R30.3(CW)
NetR29_1: R29.1 R40.3(CW)
NetR52_2: R52.2 R53.1 U5.1(ADJ/GND)

Not connected (* = marked no-connect by the designer): T5 2(S2) 8(S2)

### Notes on the sheet
- *замкнуть после измерения тока каскадов
- RF_AMP
- (near T4) Idq - 200ma Q1 + 200ma Q3, далее у одного плеча увеличивается до исчезновения 2-й гармоники
  T3:
  8-10 turns 2x0.5mm on 13.5х10х6.5 ferrit tube
  T4:
  2 parts: 5.5 turns RG-178 on Ferrite tube 13.5х10x6.5 each
  Ferrite tubes from old VGA cables
- Title
- Size:
- Date:
- A4
- Number:
- Time:
- Revision:
- Sheet
- of
- File:

### Library data of the parts
C38 C55 C80 C114-C116 C118 C126 C128 C136 C137 = CAP_0805
  C114 C116 C136 C137: Value: 100n
  C115: Value: 1nF
  C118: Value: 100nF
  C126 C128: Value: 1uF
C81 C91-C95 C105 C111 = CAP_1206
  C91 C93: Value: 2.2uF 100V
  C92 C94: Value: 1n8 100V
C119 = CAPAE_6.6x6.6h5.4: Value: 47uF
J8 = 1986717-2
L37 L38 L43 = IND_FERRITE_CORE: Inductor; Value: 10uH
L39 L47 L48 = IND_0805
Q2 = MOSFET_ENH_PD: MOSFET; Value: IRLML9301
Q7 = CMP-2000-04934-1: as Q8 on sheet CONTROL; Packaging: Tape&Reel; Package Reference: SOT23-3; Channel Mode: Enhancement; Operating Temperature: -55to150degC; Package Description: 3-Pin Small Outline Transistor, Body 2.92 x 1.325 mm, Pitch 0.95 mm; Category: MOSFET; Datasheet Version: Jun-03; Datasheet URL: https://www.fairchildsemi.com/datasheets/BS/BSS123.pdf; Manufacturer URL: https://www.fairchildsemi.com/; Mounting: SurfaceMount; Package: 3SOT-23; Package URL: http://www.fairchildsemi.com/dwg/MA/MA03D.pdf
R27-R29 R32 R41-R44 R46 R52 R53 = RES_0805
  R27 R44: Value: 56
  R28 R29 R42 R43: Value: 1k
  R41: Value: 30k
  R52: Value: 200
  R53: Value: 1.2k
R30 R40 = 306J
R34 R38 R47 R48 = RES_1206
  R47 R48: Value: 300
R37 R45 = CMP-2001-00626-1: as R13 on sheet CONTROL
T3 = TRANSF_ICORE: Transformer
T4 = TRANSF_OUT_2: Value: *
T5 = TRANSF_ACORE2: Value: 1:1
D18 D23 = SS14: Value: SS14
Q1 Q3 = RD07MVS1: Value: RD07MVS1

## Sheet SWR Tandem Match.SchDoc: SWR Tandem Match
size A4; DocumentNumber: 18; Revision: 2.0; SheetNumber: 18; SheetTotal: 18
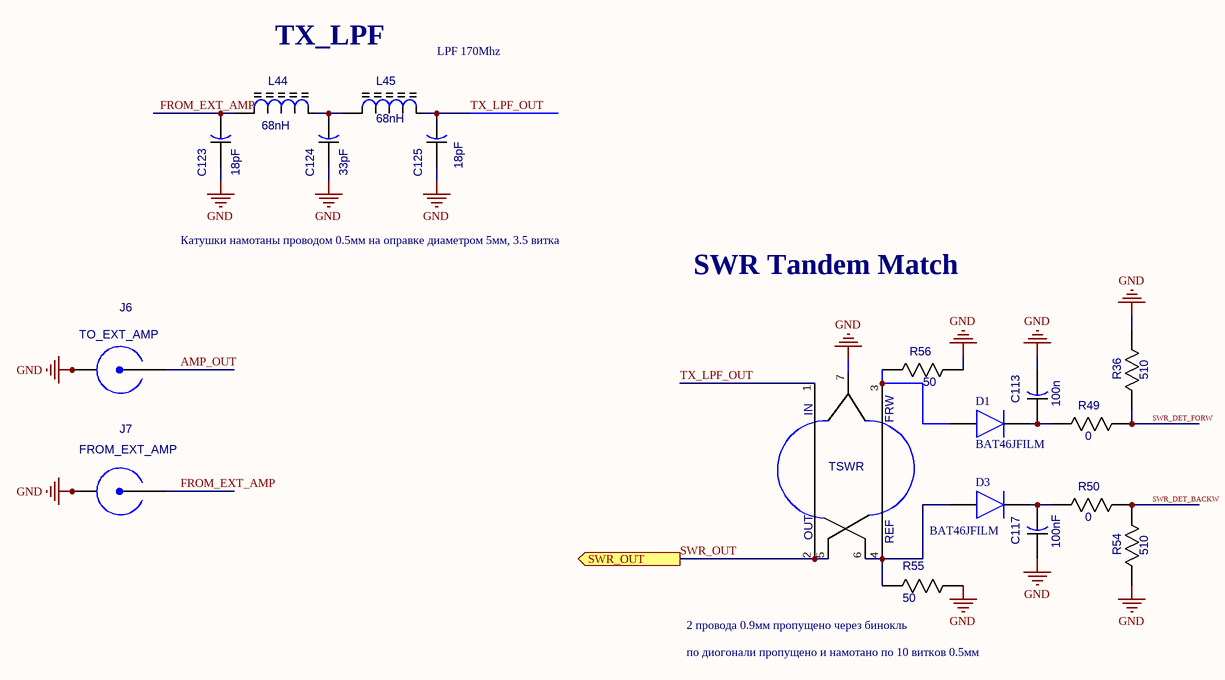
[diagram p6: SWR Tandem Match.SchDoc]

### Parts
C113  100n  [CAP_0805]
C117  100nF  [CAP_0805]
C123  18pF  [CAP_1206]
C124  33pF  [CAP_1206]
C125  18pF  [CAP_1206]
D1  BAT46JFILM  [SOD2513X117N]
D3  BAT46JFILM  [SOD2513X117N]
J6  TO_EXT_AMP  [31-5431]
J7  FROM_EXT_AMP  [31-5431]
L44  68nH  [IND_FERRITE_CORE_1]
L45  68nH  [IND_FERRITE_CORE_1]
R36  510  [RES_0805]
R49  0  [RES_0805]
R50  0  [RES_0805]
R54  510  [RES_0805]
R55  50  [RES_1206]
R56  50  [RES_1206]
TSWR  SWR_TANDEM_MATCH  [SWR_TANDEM_MATCH]  (value not drawn)

### Ports
SWR_OUT (out)

### Nets
GND: C113.2 C117.1 C123.1 C124.1 C125.1 J6.1(GND) J6.2(GND) J6.3(GND) J6.4(GND) J7.1(GND) J7.2(GND) J7.3(GND) J7.4(GND) R36.2 R54.1 R55.2 R56.2 TSWR.7
AMP_OUT: J6.5(CON)
FROM_EXT_AMP: C123.2 J7.5(CON) L44.1(A)
SWR_DET_BACKW: R50.2 R54.2
SWR_DET_FORW: R36.1 R49.2
SWR_OUT: TSWR.2 TSWR.5 ; port SWR_OUT
TX_LPF_OUT: C125.2 L45.2(B) TSWR.1
NetC113_1: C113.1 D1.1(K) R49.1
NetC117_2: C117.2 D3.1(K) R50.1
NetC124_2: C124.2 L44.2(B) L45.1(A)
NetD1_2: D1.2(A) R56.1 TSWR.3
NetD3_2: D3.2(A) R55.1 TSWR.4 TSWR.6

### Notes on the sheet
- TX_LPF
- LPF 170Mhz
- Катушки намотаны проводом 0.5мм на оправке диаметром 5мм, 3.5 витка
- SWR Tandem Match
- (near R55) 2 провода 0.9мм пропущено через бинокль
- по диогонали пропущено и намотано по 10 витков 0.5мм
- Title
- Size:
- Date:
- A4
- Number:
- Time:
- Revision:
- Sheet
- of
- File:
- (in symbol SWR_TANDEM_MATCH) IN; FRW; OUT; REF

### Library data of the parts
C113 C117 = CAP_0805
  C113: Value: 100n
  C117: Value: 100nF
C123-C125 = CAP_1206
D1 D3 = BAT46JFILM: Diode; Manufacturer_Name: STMicroelectronics; Allied_Number: 70389791; Datasheet Link: http://www.st.com/web/en/resource/technical/document/datasheet/CD00004930.pdf; Height: 1.17mm; Manufacturer_Part_Number: BAT46JFILM; Mouser Part Number: 511-BAT46JFILM; Mouser Price/Stock: https://www.mouser.co.uk/ProductDetail/STMicroelectronics/BAT46JFILM?qs=69%252BgXnvv5lrVjJqgcSQKbQ%3D%3D; RS Part Number: 7146847P; RS Price/Stock: http://uk.rs-online.com/web/p/products/7146847P; Allied Price/Stock: http://www.alliedelec.com/stmicroelectronics-bat46jfilm/70389791/
J6 J7 = 31-5431: SMA
L44 L45 = IND_FERRITE_CORE: Inductor
R36 R49 R50 R54 = RES_0805
  R36 R54: Value: 510
R55 R56 = RES_1206

## Nets that join several sheets
+3V3: BPF (12 pins), CONN (J4.1), CONTROL (8 pins), LNA (13 pins)
+12: CONN (D4.1 J3.2 K1.1), CONTROL (FAN_OUT.1 U2.9), LNA (Q5.2 R57.2), RF_AMP (7 pins)
GND: BPF (102 pins), CONN (23 pins), CONTROL (7 pins), LNA (43 pins), RF_AMP (27 pins), SWR Tandem Match (18 pins)
AMP_OUT: RF_AMP (T4.5), SWR Tandem Match (J6.5)
ANT1-2_OUT: CONN (D4.2 K1.8), CONTROL (Q8.3)
ATT_ON_0.5: CONTROL (R83.1), LNA (U9.20)
ATT_ON_1: CONTROL (R82.1), LNA (U9.19)
ATT_ON_2: CONTROL (R81.1), LNA (U9.17)
ATT_ON_4: CONTROL (R80.1), LNA (U9.16)
ATT_ON_8: CONTROL (R79.1), LNA (U9.15)
ATT_ON_16: CONTROL (R78.1), LNA (U9.1)
BAND_OUT_0: CONN (R11.2), CONTROL (U2.16)
BAND_OUT_1: CONN (R3.2), CONTROL (U2.11)
BAND_OUT_2: CONN (R9.2), CONTROL (U2.14)
BAND_OUT_3: CONN (R8.2), CONTROL (U2.13)
BPF_1_A0: BPF (U4.20 U15.20), CONTROL (R74.1)
BPF_1_A1: BPF (U4.19 U15.19), CONTROL (R73.1)
BPF_1_EN: BPF (U4.1 U15.1), CONTROL (R72.1)
BPF_2_A0: BPF (U16.20 U17.20), CONTROL (R77.1)
BPF_2_A1: BPF (U16.19 U17.19), CONTROL (R76.1)
BPF_2_EN: BPF (U16.1 U17.1), CONTROL (R75.1)
BPF_ON: BPF (U13.2 U14.2), CONTROL (R71.1)
CTRL_CLK: CONN (J4.4), CONTROL (U1.11 U3.11 U7.11)
CTRL_DATA: CONN (J4.6), CONTROL (U3.14)
CTRL_OE: CONN (J4.5), CONTROL (R35.2 U1.13 U3.13 U7.13)
CTRL_RCLK: CONN (J4.3), CONTROL (U1.12 U3.12 U7.12)
LNA_ON: CONTROL (R84.1), LNA (R31.2 U8.2 U10.2)
LPF_ON: CONTROL (R85.1), LNA (U11.2 U12.2)
MB_THERM: CONN (J4.9), CONTROL (R13.2 R14.2)
PTT_OUT: CONN (R10.2), CONTROL (U2.15)
RF_TX_IN: CONN (J9.5), RF_AMP (C55.2 L48.1)
RX_BPF_OUT: BPF (U14.4), CONN (J2.5)
RX_IN_LNA: CONN (D24.3 K1.4 K1.7 R1.2), LNA (U8.4)
RX_LPF_BPF: BPF (U13.4), LNA (U11.4)
SWR_DET_BACKW: CONN (J4.8), SWR Tandem Match (R50.2 R54.2)
SWR_DET_FORW: CONN (J4.7), SWR Tandem Match (R36.1 R49.2)
SWR_OUT: CONN (K1.2 K1.5), SWR Tandem Match (TSWR.2 TSWR.5)
TUNE_OUT: CONN (R7.2), CONTROL (U2.12)
TXAMP: CONTROL (U2.2 U3.6), RF_AMP (R37.2)